# EAGLE design Shield (EAGLE 8.7.1)
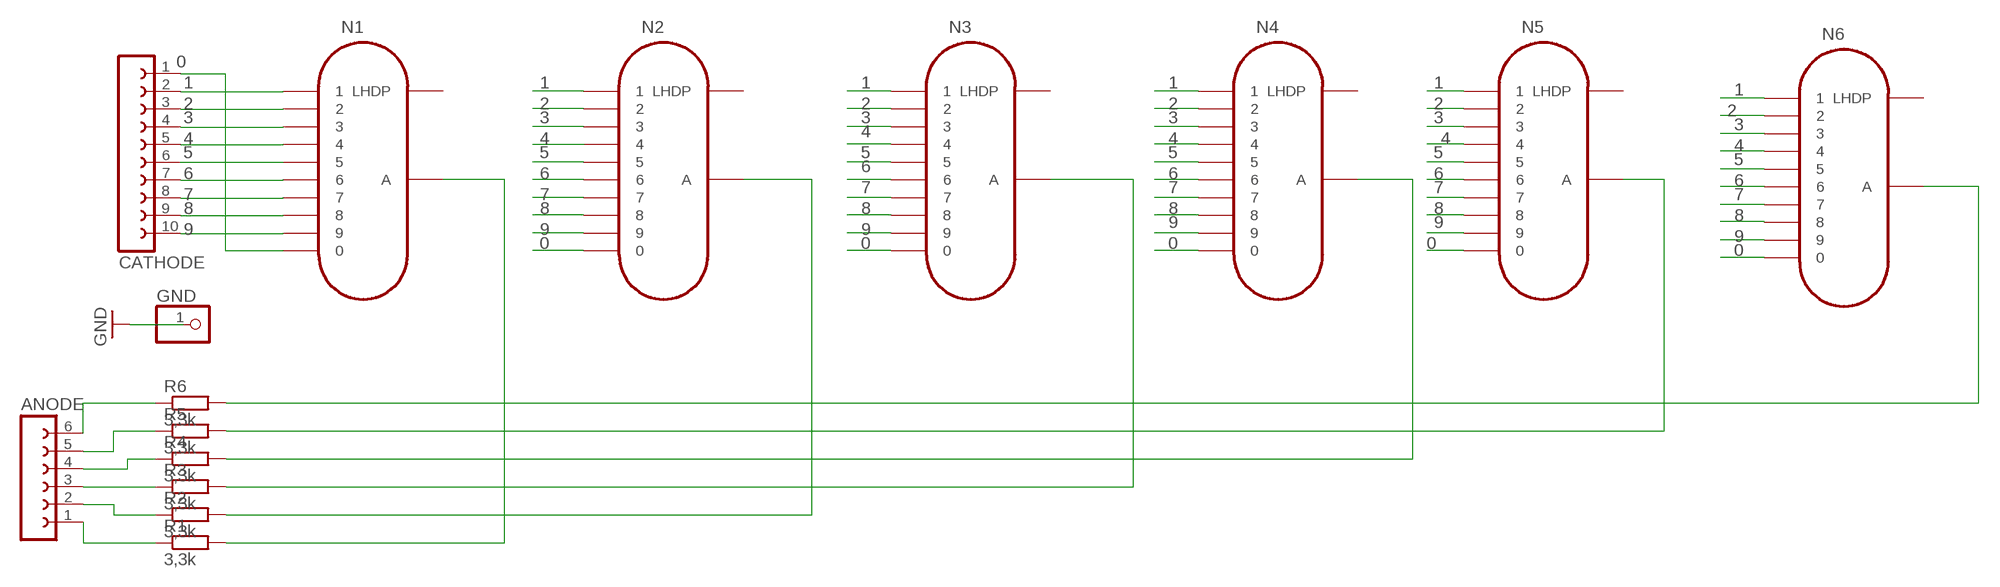
[diagram p0: schematic, sheet 1]

## Parts
ANODE  FE06-1  [FE06]
CATHODE  FE10-1  [FE10]
GND  PINHD-1X1  [1X01]
N1  IN-12B  [IN-12]
N2  IN-12B  [IN-12]
N3  IN-12B  [IN-12]
N4  IN-12B  [IN-12]
N5  IN-12B  [IN-12]
N6  IN-12B  [IN-12]
R1  3,3k  R-EU_0309/12  [0309/12]
R2  3,3k  R-EU_0309/12  [0309/12]
R3  3,3k  R-EU_0309/12  [0309/12]
R4  3,3k  R-EU_0309/12  [0309/12]
R5  3,3k  R-EU_0309/12  [0309/12]
R6  3,3k  R-EU_0309/12  [0309/12]

## Nets
0: CATHODE.1 N1.0 N2.0 N3.0 N4.0 N5.0 N6.0
1: CATHODE.2 N1.1 N2.1 N3.1 N4.1 N5.1 N6.1
2: CATHODE.3 N1.2 N2.2 N3.2 N4.2 N5.2 N6.2
3: CATHODE.4 N1.3 N2.3 N3.3 N4.3 N5.3 N6.3
4: CATHODE.5 N1.4 N2.4 N3.4 N4.4 N5.4 N6.4
5: CATHODE.6 N1.5 N2.5 N3.5 N4.5 N5.5 N6.5
6: CATHODE.7 N1.6 N2.6 N3.6 N4.6 N5.6 N6.6
7: CATHODE.8 N1.7 N2.7 N3.7 N4.7 N5.7 N6.7
8: CATHODE.9 N1.8 N2.8 N3.8 N4.8 N5.8 N6.8
9: CATHODE.10 N1.9 N2.9 N3.9 N4.9 N5.9 N6.9
GND: GND.1
N$1: ANODE.1 R1.1
N$2: ANODE.6 R6.1
N$3: ANODE.5 R5.1
N$4: ANODE.2 R2.1
N$5: ANODE.3 R3.1
N$6: ANODE.4 R4.1
N$7: N1.A R1.2
N$9: N3.A R3.2
N$10: N4.A R4.2
N$11: N5.A R5.2
N$12: N6.A R6.2
N$13: N2.A R2.2
Unconnected: N1.LHDP N2.LHDP N3.LHDP N4.LHDP N5.LHDP N6.LHDP

## Library data of the parts
ANODE = con-lsta:FE06-1: FEMALE HEADER; OC_FARNELL: unknown; OC_NEWARK: unknown
CATHODE = con-lsta:FE10-1: FEMALE HEADER; OC_FARNELL: unknown; OC_NEWARK: unknown
GND = pinhead:PINHD-1X1: PIN HEADER
N1-N6 = russian-nixies:IN-12B: IN-12B: medium numeric topview nixie tube
R1-R6 = resistor:R-EU_: RESISTOR, European symbol

## Net classes
0 default: width 0.406 mm, clearance 0.406 mm

## Board
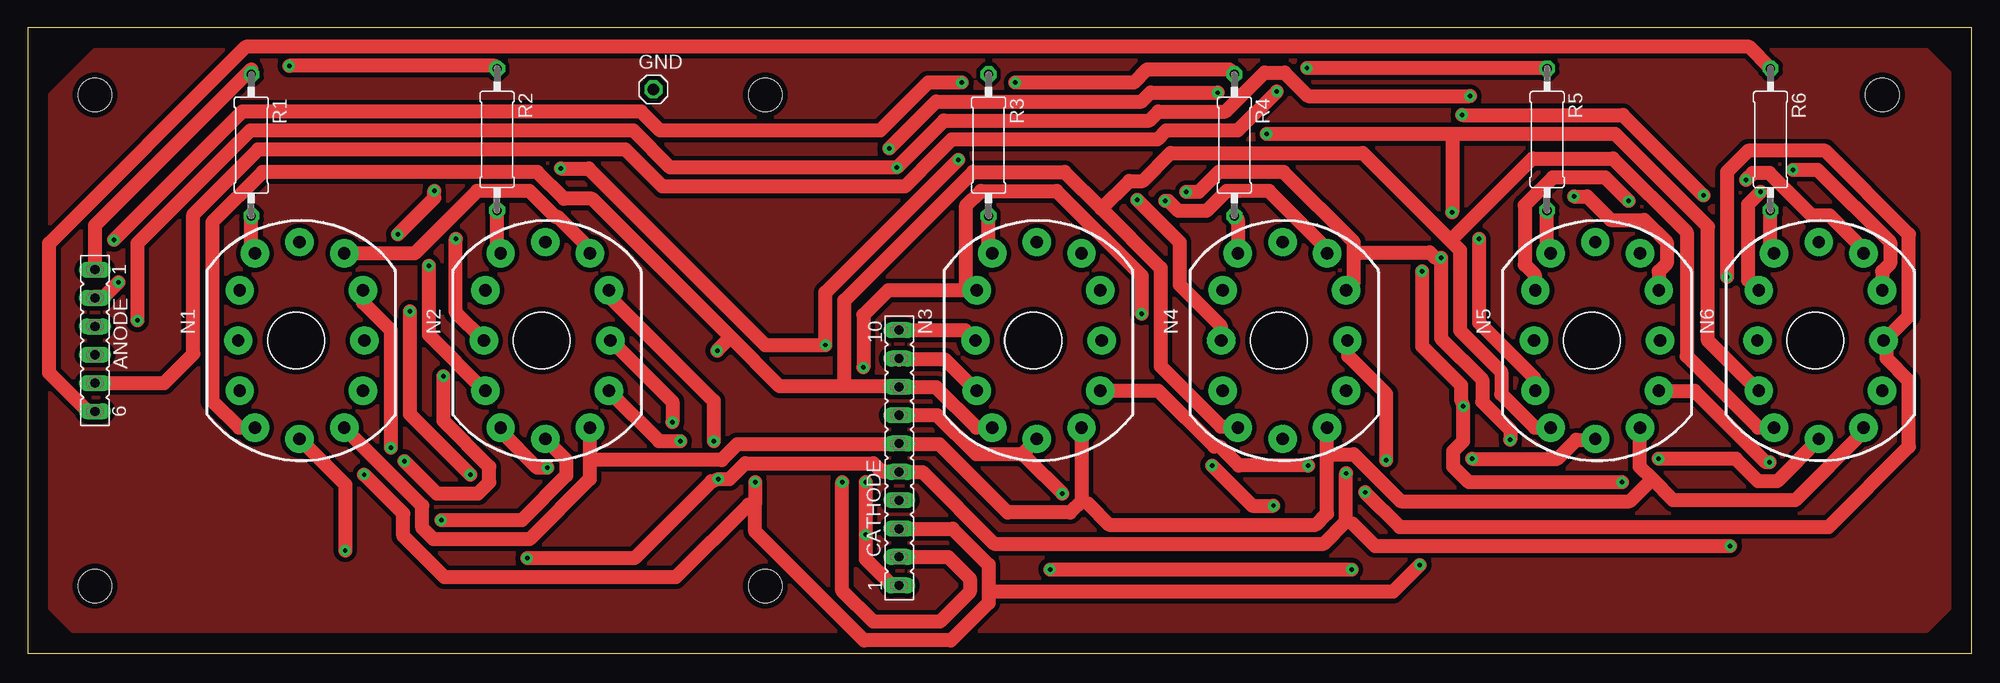
[diagram p1: board, top side]
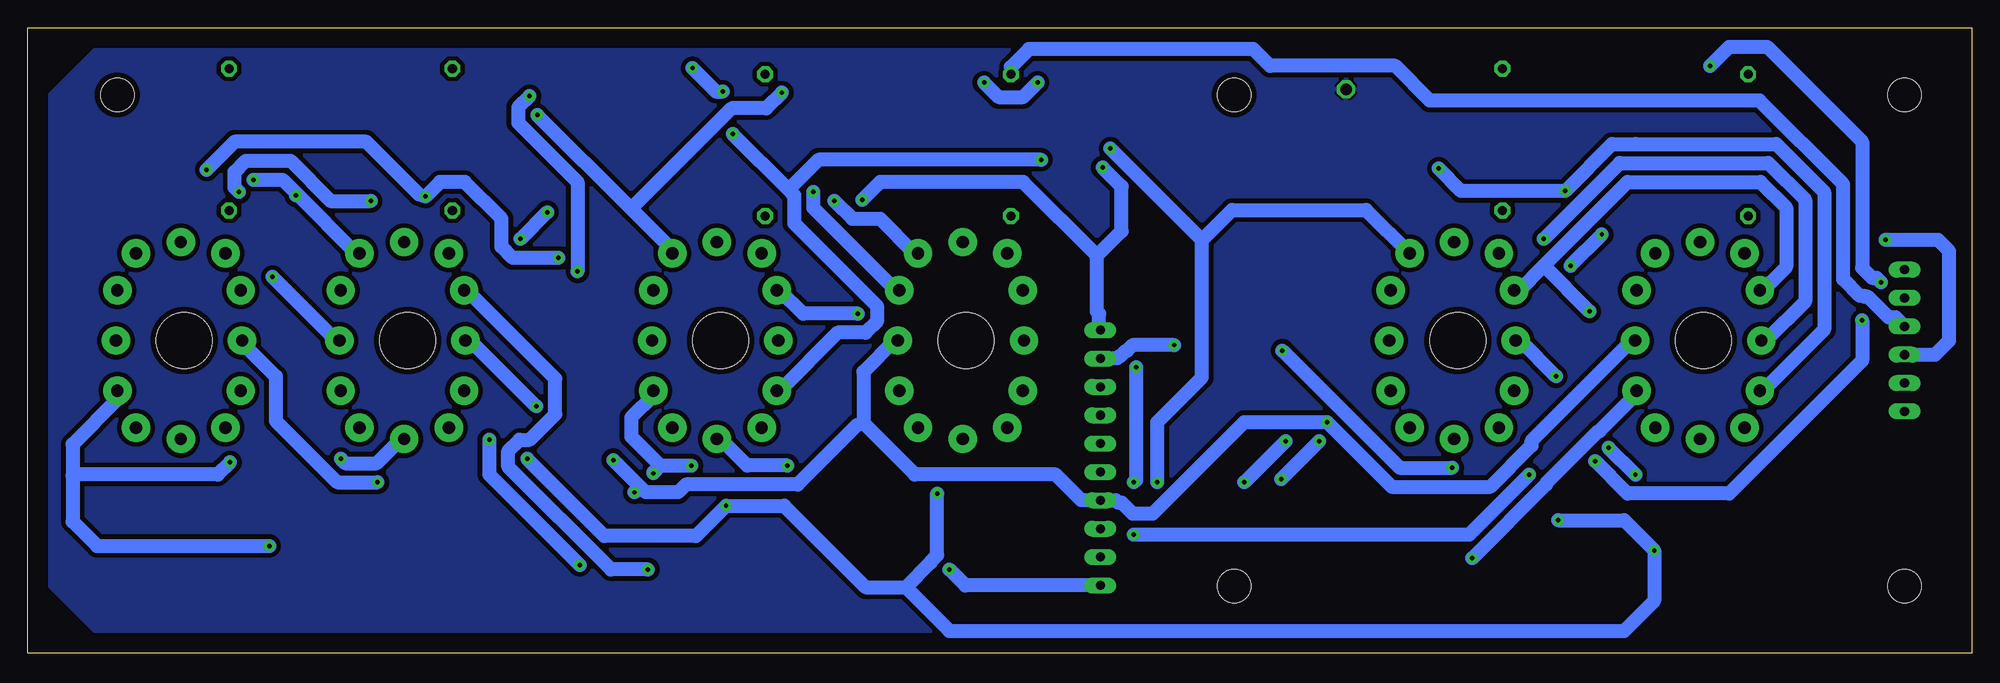
[diagram p2: board, bottom side, seen from below]

Size 174 x 56 mm. Coordinates in mm from the lower left corner, seen from the top.
Outline: 0,0 174,0 174,56 0,56 0,0
Copper layers (1*16): Top 0.035mm / dielectric 1.5mm / Bottom 0.035mm
Design rules "FVM_default": minimum track width 0.3mm, minimum drill 0.4mm, track to track 0.3mm, track to pad 0.3mm, pad to pad 0.3mm, via to via 0.3mm, smd to smd 0.15mm, copper to edge 0.5mm, drill to drill 0.2mm, minimum pad ring 0.3mm, minimum via ring 0.3mm, stop-mask expansion 0.075mm, vias tented up to drill 0mil, thermal gap 0.2mm
Holes 3 mm at 6,50 6,6 66,6 166,50 66,50

### Footprints (pad centres in the part's own frame; a part is rotated, then mirrored left to right if it is on the bottom)
FE06 = drill 0.813 long: 1 -6.35,0; 2 -3.81,0; 3 -1.27,0; 4 1.27,0; 5 3.81,0; 6 6.35,0
FE10 = drill 0.813 long: 1 -11.43,0; 2 -8.89,0; 3 -6.35,0; 4 -3.81,0; 5 -1.27,0; 6 1.27,0; 7 3.81,0; 8 6.35,0; 9 8.89,0; 10 11.43,0
1X01 = drill 1.016 octagon: 1 0,0
IN-12 = drill 1.1 pad 2.54: 0 5.048,-4.5; 1 -4.317,-7.817; 2 -6,-4.5; 3 -6.127,0; 4 -6,4.5; 5 -4.317,7.817; 6 -0.318,8.818; 7 3.683,7.817; 8 5.048,4.5; 9 5.175,0; A 3.683,-7.817; LHDP -0.318,-8.818 | hole 5: 0,0
0309/12 = drill 0.813 octagon: 1 -6.35,0; 2 6.35,0

### Placement (x,y rotation side)
ANODE  6,28 270 top
CATHODE  78,17.5 90 top
GND  56,50.5 0 top
N1  24,28 180 top
N2  46,28 180 top
N3  90,28 180 top
N4  112,28 180 top
N5  140,28 180 top
N6  160,28 180 top
R1  20,45.5 270 top
R2  42,46 270 top
R3  86,45.5 270 top
R4  108,45.5 270 top
R5  136,46 270 top
R6  156,46 270 top

### Tracks (layer width: path | path; a pad name or v marks a point on that pad's centre or on a via)
0  (via drill 0.4)
  Top 1.27: v143.3,40.5 141.2,42.6 136.5,42.6 135.3,41.4 135.28,41.4 134,40.12 134,34.8 134.9,33.9 134.9,32.5 N5.0 | v155.1,41.3 154,40.2 154,33.4 154.9,32.5 N6.0 | v75,15.3 v75,10.6 75,8.43 77.36,6.07 CATHODE.1 | v99.7,30.4 99.7,33.8 92.1,41.4 85.3,41.4 84,40.1 84,33.1 N3.0 77,32.5 74.8,30.3 v74.8,25.6 | v34.2,30.6 34.2,21.4 v39.6,16 | v91.5,7.5 v118.5,7.5
  Bottom 1.27: N1.0 18.7,32.5 16.6,34.6 16.6,39.9 18.9,42.2 30.8,42.2 38.3,34.7 | 38.3,34.7 40.5,32.5 N2.0 | v143.3,40.5 146.9,40.5 150.5,44.1 154.5,44.1 155.5,43.1 155.5,41.7 v155.1,41.3 | v75,15.3 74.8,15.5 v74.8,25.6 | N4.0 106.7,32.5 104.6,30.4 v99.7,30.4 | N5.0 134.7,32.5 126.8,24.6 126.8,21.4 129.1,19.1 130,19.1 131,18.1 131,16.7 121.8,7.5 v118.5,7.5 | v34.2,30.6 38.3,34.7 | CATHODE.1 90.07,6.07 v91.5,7.5 | v75,10.6 45,10.6 v39.6,16
1  (via drill 0.4)
  Top 1.27: v153.8,42.4 154.4,43 155.9,43 159.7,39.2 161.3,39.2 164.3,36.2 164.3,35.9 N6.1 | v101.8,40.5 102.1,40.5 103,39.6 105.5,39.6 107.3,41.4 111.1,41.4 116.3,36.2 116.3,35.9 N4.1 | v150,41 142.8,48.2 v128.4,48.2 | N1.1 28.4,35.8 34.6,35.8 40.2,41.4 44.9,41.4 47.2,39.1 47.4,39.1 50.1,36.4 N2.1 | v106.5,50.2 100.5,50.2 99.7,49.4 81.3,49.4 v77.1,45.2 | CATHODE.2 82.39,8.61 84.32,6.68 84.32,5.5 81.64,2.81 75.69,2.81 72.9,5.6 v72.9,15.3
  Bottom 1.27: 149.9,41.1 151.2,42.4 v153.8,42.4 | 149.9,41.1 144.7,35.9 144.4,35.9 N5.1 | v101.8,40.5 100.2,38.9 97.7,38.9 94.7,35.9 94.4,35.9 N3.1 | 120,39.8 116.4,36.2 116.4,35.9 N4.1 | 120,39.8 v128.4,48.2 | v150,41 149.9,41.1 | 120,39.8 111,48.8 107.9,48.8 v106.5,50.2 | v72.9,15.3 72.9,20.7 68.9,24.7 68.9,37 | 68.9,37 v77.1,45.2 | 68.9,37 66.2,39.7 54.2,39.7 N2.1
2  (via drill 0.4)
  Top 1.27: v65.1,15.3 65.1,13.5 | v61.4,19 61.4,22.6 52,32 N2.2 | N1.2 30,31.4 32.5,28.9 v32.5,18.4 | v30.1,16 33.6,12.5 33.6,10.5 37.3,6.8 58,6.8 64.5,13.3 65.1,13.5 | v103.7,41.3 104.8,41.3 106.6,43.1 112.4,43.1 118.7,36.8 118.7,35.9 | 118.7,35.9 118.7,33.2 N4.2 | N5.2 146,34.2 146.7,34.9 146.7,36.8 144.7,38.8 141.7,38.8 139.6,40.9 v138.4,40.9 | 118.7,35.9 125.5,35.9 126,35.4 v126.5,35.4 126.5,28.2 130.2,24.5 130.2,22.5 132.7,20 v132.7,19.1 | N6.2 166,34.2 166.7,34.9 166.7,36.8 160.2,43.3 v158,43.3 | CATHODE.3 82.78,11.15 86,7.93 86,5.5 | 86,5.5 86,4.5 82.64,1.14 74.86,1.14 65.1,10.9 65.1,13.5 | 86,5.5 122.2,5.5 v124.6,7.9
  Bottom 1.27: v61.4,19 v65.1,15.3 | v30.1,16 v32.5,18.4 | N3.2 96.3,32.5 103.7,39.9 v103.7,41.3 | v126.5,35.4 130.6,35.4 131.6,36.4 131.6,38.9 134.9,42.2 137.1,42.2 v138.4,40.9 139,41.1 143.7,45.8 155.5,45.8 v158,43.3 | v124.6,7.9 132.7,16 v132.7,19.1
3  (via drill 0.4)
  Top 1.27: v57.7,20.7 57.7,22.5 52.2,28 N2.3 | v152.1,33.7 152.1,43.1 154,45 160.9,45 168.4,37.5 168.4,30.2 166.2,28 N6.3 166.4,27.4 166.4,26.4 168.4,24.4 168.4,18.5 161.2,11.3 122.8,11.3 v119.7,14.4 | v121.6,17.3 121.6,23.2 118.2,26.6 118.2,28 N4.3
  Bottom 1.27: N1.3 30.4,28 39.4,19 39.4,18.6 43.1,14.9 51.9,14.9 v57.7,20.7 65.1,20.7 73.3,12.5 75.1,12.5 76.1,13.5 76.4,13.5 76.6,13.7 77.4,13.7 CATHODE.4 | N5.3 146.4,28 v152.1,33.7 | 99.2,20.6 94.6,16 82,16 79.69,13.69 CATHODE.4 | 99.2,20.6 99.2,25.2 96.4,28 N3.3 | CATHODE.4 | 119.2,14.9 118.7,14.4 115.8,14.4 115.1,15.1 105.1,15.1 99.8,20.4 99.2,20.6 | 119.2,14.9 v121.6,17.3 | v119.7,14.4 119.2,14.9
4  (via drill 0.4)
  Top 1.27: N5.4 149.2,23.5 155.6,17.1 v155.9,17.1 | N3.4 101.2,23.5 106.2,18.5 106.7,18.5 108.4,16.8 v114.6,16.8 | v58.4,19 56.5,19 N2.4 | CATHODE.5 78,16.3 76.4,16.3 75.7,17 64.2,17 62.8,15.6 v61.8,15.6 61.2,15.4 54.3,8.5 v44.7,8.5 | 118,11.8 v118,16.1 | 118,11.8 116,9.8 86.5,9.8 80.07,16.23 CATHODE.5 | 78.6,16.2 CATHODE.5 | v152.4,9.6 120.6,9.6 118.6,11.6 118,11.8
  Bottom 1.27: 117.4,16.8 v114.6,16.8 | 117.4,16.8 120,19.4 120,21.1 118,23.1 N4.4 | v58.4,19 v61.8,15.6 | N1.4 30,23.2 33.3,19.9 33.4,19.9 38.1,15.2 38.1,15.1 v44.7,8.5 | v118,16.1 118,16.2 117.4,16.8 | v155.9,17.1 157,16 169.9,16 170,15.9 | 161.8,9.6 167.8,9.6 170,11.8 170,15.9 | 161.8,9.6 v152.4,9.6 | N6.4 166,22.7 170,18.7 170,15.9 | 161.8,9.6
5
  Top 1.27: N1.5 35.3,13.2 35.3,11.2 36.3,10.2 44.9,10.2 50.3,15.6 50.3,17.3 | 50.3,17.3 50.3,20.1 N2.5 | 145.4,15.6 147.3,13.7 158.2,13.7 164.3,19.8 164.3,20.1 N6.5 | 145.4,15.6 144.3,16.7 144.3,20.1 N5.5 | 94.3,13.6 93.3,12.6 87.7,12.6 81.6,18.7 78,18.7 CATHODE.6 77.4,18.7 63.5,18.7 62.1,17.3 50.3,17.3 | 94.3,13.6 94.3,20.1 N3.5 | 116.3,17.8 116.3,12.5 115.3,11.5 96.8,11.5 94.9,13.4 94.3,13.6 | 116.3,17.8 116.3,20.1 N4.5 | 145.4,15.6 143.4,13.6 122.9,13.6 118.7,17.8 116.3,17.8
6  (via drill 0.4)
  Top 1.27: 24.6,19.1 24.4,19.1 N1.6 28.4,15.1 v28.4,9.2 | v37,11.9 44.2,11.9 48.2,15.9 48.2,17.3 N2.6 | v146,17.4 152.9,17.4 154.9,15.4 156.6,15.4 160.3,19.1 N6.6 | 89,17.8 84.9,17.8 81.4,21.3 CATHODE.7 | 89,17.8 90.3,19.1 N3.6 | v92.6,14.3 89.4,17.5 89,17.8 | v129.3,17.4 136.9,17.4 138.6,19.1 140.3,19.1 N5.6 | v111.5,13.2 109.6,13.2 v106,16.8
  Bottom 1.27: v146,17.4 145.6,17 142.8,17 140.7,19.1 140.4,19.1 N5.6 | v106,16.8 109.6,16.8 111.9,19.1 112.3,19.1 N4.6 | v37,11.9 31.1,11.9 v28.4,9.2 28.4,4.7 31.1,2 91.5,2 95.4,5.9 | v129.3,17.4 122.4,10.5 114.2,10.5 v111.5,13.2 106.3,13.2 99,5.9 95.4,5.9 | 95.4,5.9 93.18,8.12 93.18,8.19 92.6,8.77 v92.6,14.3
7  (via drill 0.4)
  Top 1.27: 108.81,19.91 N4.7 107.7,20.3 106.8,20.3 101.4,25.7 101.4,34.5 96.1,39.8 | N3.7 86.3,20.2 84.9,20.2 81.3,23.8 78,23.8 CATHODE.8 77.4,23.9 73.1,23.9 | 62.9,28.3 67.3,23.9 73.1,23.9 | 62.9,28.3 50.5,40.7 48,40.7 45.6,43.1 21,43.1 16.5,38.6 16.5,22.6 18.9,20.2 20.3,20.2 N1.7 | v46.5,16.6 45.6,16.6 42.4,19.8 42.4,20.1 N2.7 | 62.9,28.3 v61.7,27.1 | 96.1,39.8 92.8,43.1 84.6,43.1 73.1,31.6 73.1,23.9 | 127.35,36.95 119.5,44.8 102.3,44.8 99.8,42.3 98.6,42.3 96.1,39.8 | 127.35,36.95 128.2,36.1 128.2,28.9 131.9,25.2 131.9,23.2 134.9,20.2 136.3,20.2 N5.7 | 127.35,36.95 134.7,44.3 141.9,44.3 148.5,37.7 148.5,26.6 154.9,20.2 156.3,20.2 N6.7
  Bottom 1.27: v46.5,16.6 51.2,16.6 v61.7,27.1
8  (via drill 0.4)
  Top 1.27: 127.5,46.5 142.1,46.5 150.4,38.2 150.4,28 154.9,23.5 N6.8 | 127.5,46.5 v110.9,46.5 | v129.9,37.1 129.9,29.6 134.9,24.6 134.9,23.5 N5.8 | 127.5,46.5 v127.5,39.5 | CATHODE.9 78,26.3 82.1,26.3 84.9,23.5 N3.8 | v35.9,34.7 35.9,28.5 40.9,23.5 N2.8 | v47.7,43.4 50.2,43.4 66,27.6 v71.4,27.6 71.4,32.3 v83.3,44.2 | v33.1,37.5 36.37,40.77 v36.37,41.4
  Bottom 1.27: N4.8 106.7,23.5 101.5,28.7 99,28.7 98,29.7 98,31.1 105.4,38.5 105.4,41 105.9,41.5 | v110.9,46.5 105.9,41.5 | v127.5,39.5 v129.9,37.1 | N1.8 18.7,23.5 13.2,29 13.2,41.3 17.5,45.6 30.1,45.6 | 32.2,45.6 30.1,45.6 | v35.9,34.7 v33.1,37.5 | v71.4,27.6 75.1,27.6 75.6,27.1 75.7,27.1 76.2,26.6 76.3,26.6 76.5,26.4 CATHODE.9 | 105.9,41.5 103.2,44.2 v83.3,44.2 | v47.7,43.4 45.7,41.4 v36.37,41.4 32.19,45.58 30.12,45.58 30.1,45.6
9  (via drill 0.4)
  Top 1.27: v142.7,15.3 129,15.3 127.6,16.7 127.6,18.1 128.5,19 v128.5,22.1 128.3,22.7 128.3,24 124.8,27.5 v124.8,34.2 | CATHODE.10 78,28.9 83.9,28.9 84.8,28 N3.9 | v99.3,40.6 103.1,36.8 103.1,33 106.8,29.3 106.8,28 N4.9 | v129.1,49.9 114.6,49.9 112.5,52 110.7,52 107.2,48.5 101.2,48.5 100.4,47.7 82,47.7 v77.8,43.5 57.5,43.5 54.2,46.8 19.9,46.8 9.8,36.7 v9.8,29.8 | v37.2,24.8 37.2,20.8 41.3,16.7 41.3,15.3 40.3,14.3 36.6,14.3 v33.7,17.2 | N2.9 38.3,30.53 v38.3,37.1
  Bottom 1.27: N1.9 18.4,28 14.9,31.5 14.9,40.6 18.2,43.9 31.5,43.9 v38.3,37.1 | N5.9 134.4,28 v128.5,22.1 | v142.7,15.3 146.3,15.3 151.8,20.8 151.8,24.8 154.8,27.8 154.8,28 N6.9 | v99.3,40.6 97.7,42.2 84.9,42.2 78.3,35.6 | 78.3,35.6 78.3,30.6 78.1,30.4 78.1,29.4 78,29.3 CATHODE.10 | v124.8,34.2 124.8,42.2 130.1,47.5 130.1,48.9 v129.1,49.9 | N2.9 40.4,28 v37.2,24.8 | v33.7,17.2 30.8,14.3 21.7,14.3 9.8,26.2 v9.8,29.8 | 78.3,35.6 76.1,37.8 76.1,41.8 v77.8,43.5
GND
  pour Bottom: 2,38 2,50 6,54 168,54 172,50 172,6 168,2 6,2 2,6
N$1
  Top 1.27: ANODE.1 6,38.3 20,52.3 R1.1
N$2
  Top 1.27: R6.1 156,52.4 154.1,54.3 19.5,54.3 1.9,36.7 1.9,25.11 5.36,21.65 ANODE.6
N$3  (via drill 0.4)
  Top 1.27: v111.8,50.3 108.3,46.8 101.9,46.8 101.1,46 82.7,46 81.35,44.65 78.5,41.8 56.8,41.8 53.5,45.1 20.6,45.1 14.8,39.3 14.8,26.8 12.19,24.19 ANODE.5 | v114.5,52.4 136,52.4 R5.1
  Bottom 1.27: v111.8,50.3 112.4,50.3 v114.5,52.4
N$4  (via drill 0.4)
  Top 1.27: v8.1,33.2 6.8,31.9 6,31.9 ANODE.2 | v23.4,52.6 41.8,52.6 42,52.4 R2.1
  Bottom 1.27: v8.1,33.2 8.5,33.6 8.9,33.6 9.8,34.5 9.8,45.8 18.3,54.3 21.7,54.3 v23.4,52.6
N$5
  Bottom 1.27: ANODE.3 6.79,30.06 7.43,30.06 9.29,31.92 9.59,31.92 9.67,32 10,32 11.5,33.5 11.5,42 19,49.5 48.5,49.5 51.6,52.6 62.8,52.6 64.3,54.1 84.4,54.1 86,52.5 R3.1
N$6  (via drill 0.4)
  Top 1.27: 5.4,26.8 6,26.8 ANODE.4 | v7.7,37 19.2,48.5 54.9,48.5 56.6,46.8 76.3,46.8 80.6,51.1 v83.6,51.1 | v88.4,51.1 99,51.1 100.2,52.3 107.55,52.3 R4.1
  Bottom 1.27: v83.6,51.1 84.9,49.8 87.1,49.8 v88.4,51.1 | ANODE.4 3.27,26.73 2,28 2,36 3,37 v7.7,37
N$7
  Top 1.27: R1.2 20,36.2 20.3,35.9 N1.A
N$8
  pour Top: 2,4 2,50 6,54 170,54 172,52 172,4 170,2 4,2
N$9
  Top 1.27: R3.2 86,36.2 86.3,35.9 N3.A
N$10
  Top 1.27: R4.2 108.32,38.83 N4.A
N$11
  Top 1.27: R5.2 136,36.2 136.3,35.9 N5.A
N$12
  Top 1.27: R6.2 156,36.2 156.3,35.9 N6.A
N$13
  Top 1.27: R2.2 42,36.2 42.3,35.9 N2.A